# Altium schematic sheet 31_1_Conector_USB.SchDoc
size A4; SheetNumber: 11; SheetTotal: 11
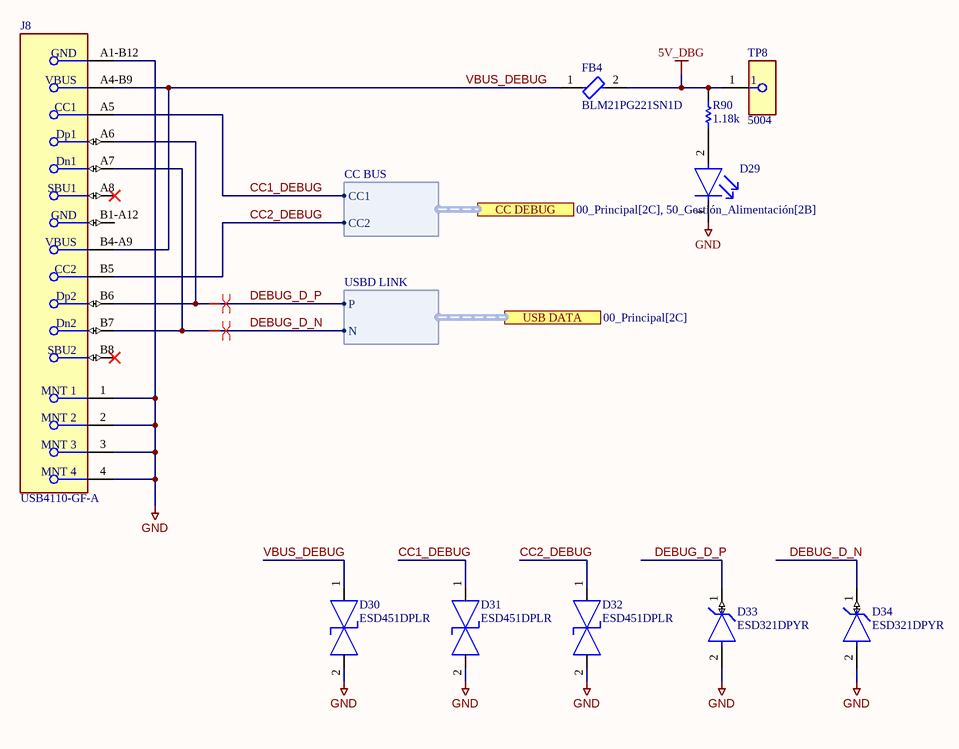
[diagram p0: 31_1_Conector_USB.SchDoc]

## Parts
D29  APHD1608LZGCK  [FP-APHD1608LZGCK-MFG]  (value not drawn)
D30  ESD451DPLR  [FP-DPL0002A_MFG]
D31  ESD451DPLR  [FP-DPL0002A_MFG]
D32  ESD451DPLR  [FP-DPL0002A_MFG]
D33  ESD321DPYR  [FP-DPY0002A-MFG]
D34  ESD321DPYR  [FP-DPY0002A-MFG]
FB4  BLM21PG221SN1D  [FP-BLM21-0_2-t0_85-e0_5-IPC_B]
J8  USB4110-GF-A  [FP-USB4110-GF-A-MFG]
R90  1.18k  [RESC1005X40X25NL05T05]
TP8  5004  [FP-5004-MFG]

## Ports
CC DEBUG (harness CC BUS, see 00_Principal[2C], 50_Gestión_Alimentación[2B]), USB DATA (harness USBD LINK, see 00_Principal[2C])

## Harnesses
USBD LINK: P, N
CC BUS: CC1, CC2

## Nets
5V_DBG: FB4.2 R90.2 TP8.1
GND: D29.1(C) D30.2(2_IO) D31.2(2_IO) D32.2(2_IO) D33.2(GND) D34.2(GND) J8.1(MNT_1) J8.2(MNT_2) J8.3(MNT_3) J8.4(MNT_4) J8.A1-B12(GND)
CC1_DEBUG: D31.1(1_IO) J8.A5(CC1) ; port CC DEBUG.CC1
CC2_DEBUG: D32.1(1_IO) J8.B5(CC2) ; port CC DEBUG.CC2
DEBUG_D_N: D34.1(IO) J8.A7(Dn1) J8.B7(Dn2) ; port USB DATA.N
DEBUG_D_P: D33.1(IO) J8.A6(Dp1) J8.B6(Dp2) ; port USB DATA.P
VBUS_DEBUG: D30.1(1_IO) FB4.1 J8.A4-B9(VBUS) J8.B4-A9(VBUS)
NetD29_2: D29.2(A) R90.1

Not connected (* = marked no-connect by the designer): J8 A8(SBU1)* B1-A12(GND) B8(SBU2)*

## Layout directives
differential pair; rule Differential Pairs Routing [Pref Gap = 5mil    Min Gap  = 5mil    Max Gap  = 5milPref Width = 8.655mil    Min Width  = 8.655mil    Max Width  = 8.655mil]: DEBUG_D_N, DEBUG_D_P

## Library data of the parts
D29 = CMP-44529-000045-1: LED GREEN CLEAR 1608 SMD; Test Current: 2mA; Dominant Wavelength: 525nm; Lens Color: Colorless; Luminous Intensity: 180mcd; Viewing Angle: 100°; Forward Voltage: 2.65V; Lens Size: 0.7mm; Lens Style: Round; Mount: Surface Mount; Packaging: Tape and Reel; Lens Transparency: Clear; Height: 0.75mm; Case/Package: 0603; Length: 1.6mm; Case Code (Metric): 1608; Width: 0.8mm; Color: Green; Case Code (Imperial): 0603
D30-D32 = CMP-00370-140306676-1: 0.5-pF, 5.5-V, 30-KV bidirectional ESD protection device in 0201 package 2-X2SON -40 to 125; Manufacturer Lifecycle Status: ACTIVE; Thickness: 300µm; ComponentLink3URL: https://www.ti.com/lit/ds/symlink/tpd1e04u04.pdf?ts=1701165483995&ref_url=https%253A%252F%252Fwww.ti.com%252Fproduct%252FTPD1E04U04%252Fpart-details%252FTPD1E04U04DPLR; ComponentLink3Description: Manufacturer's Package Drawing; Lifecycle Status: Production; ComponentLink1URL: http://ti.com; ComponentLink2Description: HelpURL; Width: 300µm; ComponentLink2URL: https://www.ti.com/lit/ds/symlink/esd451.pdf; Height: 320µm; Number of Pins: 2; ComponentLink1Description: Manufacturer's Website; Length: 600µm
D33 D34 = CMP-04989-000001-1: HDMI2.0 ESD PROTECTION; Manufacturer: Texas Instruments; Standoff Height: 0mm; Peak Pulse Current: 6A; Value: 0.9pF; Number Of Channels: 1; Reverse Standoff Voltage: 3.6V; Peak Pulse Power: 40W; Breakdown Voltage: 4.5V; Direction: Unidirectional; Clamping Voltage: 6.8V; RoHS: TRUE; Temperature: -40°C to +125°C; Package: DPY0002A; Temperature Range Low: -40°C; Temperature Range High: +125°C; Category: Diode; Capacitance: 0.9pF; Ambient Temperature Range Low: -40°C; Device Class L3: unset; Device Class L1: Circuit Protection; Ambient Temperature Range High: +125°C; ComponentLink2URL: http://www.ti.com/lit/ds/symlink/esd321.pdf; Octopart: https://octopart.com/esd321dpyr-texas+instruments-94354200; Manufacturer Part Number: ESD321DPYR; Digikey Description: HDMI2.0 ESD PROTECTION; Lead Free: Yes; ComponentLink2Description: Datasheet; Device Class L2: TVS Diodes; Height: 0.45mm; Automotive: No
FB4 = CMP-0686-00610-3: Chip Ferrite Bead, 0805, 220Ω @ 100MHz, 0.045Ω, 25%, 2A; Number of Circuits: 1; Shielding: Unshielded; DC Resistance (DCR): 45mR; Impedance: 220R; Radiation Hardening: No; Material: Ferrite; Frequency: 100MHz; Width: 1.25mm; DC Current: 2A; Max DC Current: 2A; Number of Lines: 1; Package Quantity: 1; Case Code (Metric): 2012; Current Rating: 2A; Case/Package: 0805; Current: 2A; Military Standard: Not; Core Material: Ferrite; Depth: 1.25mm; Contact Plating: Tin; DC Resistance-Max: 45mR; Max Operating Temperature: 125°C; Length: 2mm; Max Current Rating: 2A; REACH SVHC: No SVHC; Termination: SMD/SMT; Min Operating Temperature: -55°C; Series: BLM21P; Test Frequency: 100MHz; Tolerance: 25%; Number of Pins: 2; RoHS Compliant: Yes; Height: 0.85mm; Packaging: Tape and Reel; Lead Free: Lead Free; Case Code (Imperial): 0805
J8 = CMP-245163-000002-1: CONN USB 2.0 TYPE-C R/A SMT; Manufacturer: GCT; Conn Orientation: Right Angle; Usb Standard: USB 2.0; Voltage Rating: 20V; Current Rating: 3/4.25/1.25/0.25A; Number Of Contacts: 16; Is Female: yes; Shielding: true; Standoff Height: 0.1mm; Octopart: https://octopart.com/usb4110-gf-a-gct-103941985; Temperature: -40°C to +85°C; RoHS: TRUE; Automotive: No; Contact Material: Gold,Nickel; Device Class L1: Connectors; Device Class L2: USB Connectors; Package: 0; Lead Free: Yes; ComponentLink2URL: https://gct.co/files/drawings/usb4110.pdf; Temperature Range High: +85°C; Temperature Range Low: -40°C; Height: 3.46mm; Manufacturer Part Number: USB4110-GF-A; ComponentLink2Description: Datasheet; Device Class L3: unset; Digikey Description: CONN USB 2.0 TYPE-C R/A SMT; Category: Conn
R90 = CMP-1011-00517-2: Part Number: ERJ-2RKF1181X; Manufacturer: Panasonic
TP8 = CMP-2000-05575-2: PC TEST POINT MINIATURE YELLOW; Manufacturer: Keystone; Number Of Contacts: 1; Is Female: yes; Device Class L1: Connectors; Manufacturer Part Number: 5004; Digikey Description: PC TEST POINT MINIATURE YELLOW; ComponentLink2URL: https://www.keyelco.com/product-pdf.cfm?p=1313; Lead Free: Yes; ComponentLink2Description: Datasheet; Category: Conn; Height: 4.72mm; Octopart: https://octopart.com/5004-keystone-28591; Mouser Description: TEST POINT PC MINI .040"D YELLOW; Device Class L3: unset; Contact Material: Silver; Package: 5004; Automotive: No; Device Class L2: unset; RoHS: TRUE